# Altium schematic sheet Project_Information.SchDoc: =project_title
size Tabloid; CompanyName: Luxonis Holding; Organization: Luxonis Holding; Address1: 1925 Harmony Park Drive; Address2: Westminster, CO; Address3: 80234; Address4: United States; SheetNumber: 1; SheetTotal: 12
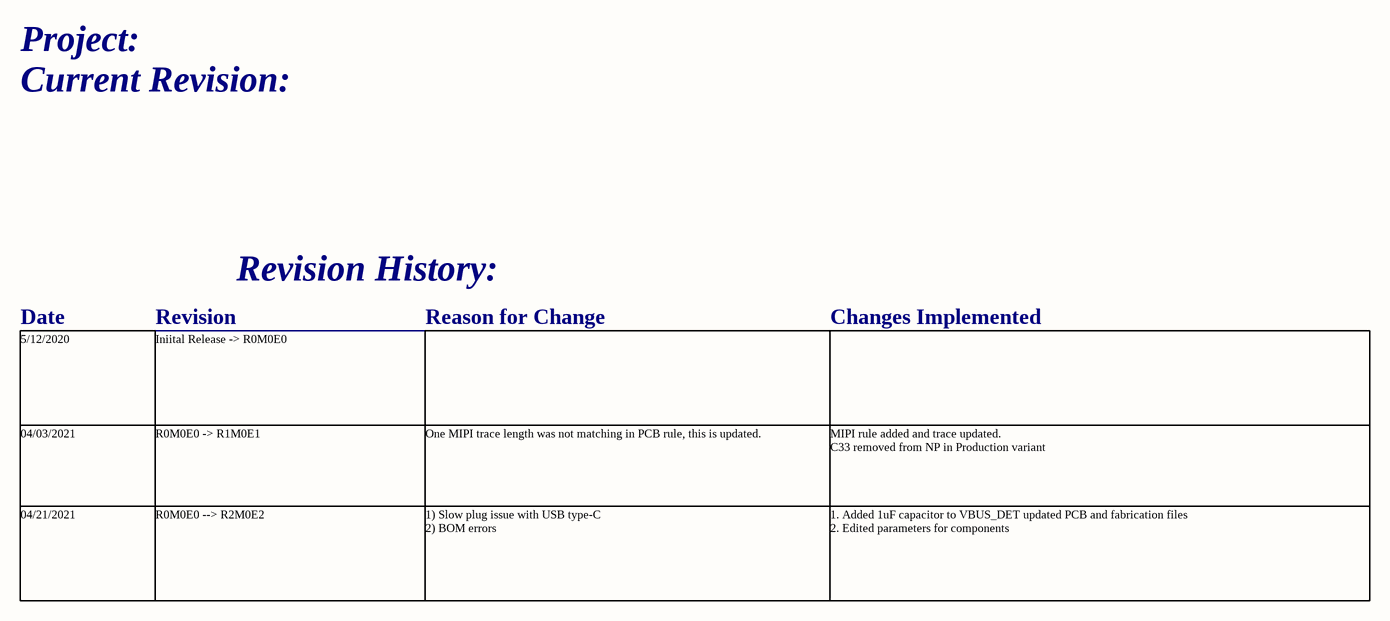
[diagram p0: Project_Information.SchDoc]

## Notes on the sheet
- Project:
- Current Revision:
- Revision History:
- Date
- Revision
- Reason for Change
- Changes Implemented
- 5/12/2020
- Iniital Release -> R0M0E0
- 04/03/2021
- R0M0E0 -> R1M0E1
- One MIPI trace length was not matching in PCB rule, this is updated.
- MIPI rule added and trace updated.
  C33 removed from NP in Production variant
- 04/21/2021
- R0M0E0 --> R2M0E2
- 1) Slow plug issue with USB type-C
  2) BOM errors
- 1. Added 1uF capacitor to VBUS_DET updated PCB and fabrication files
  2. Edited parameters for components
- Title
- Size:
- Date:
- Tabloid
- Number:
- Time:
- Revision:
- Sheet
- of
- Drawn by: